# Altium project EG8010.PrjPcb
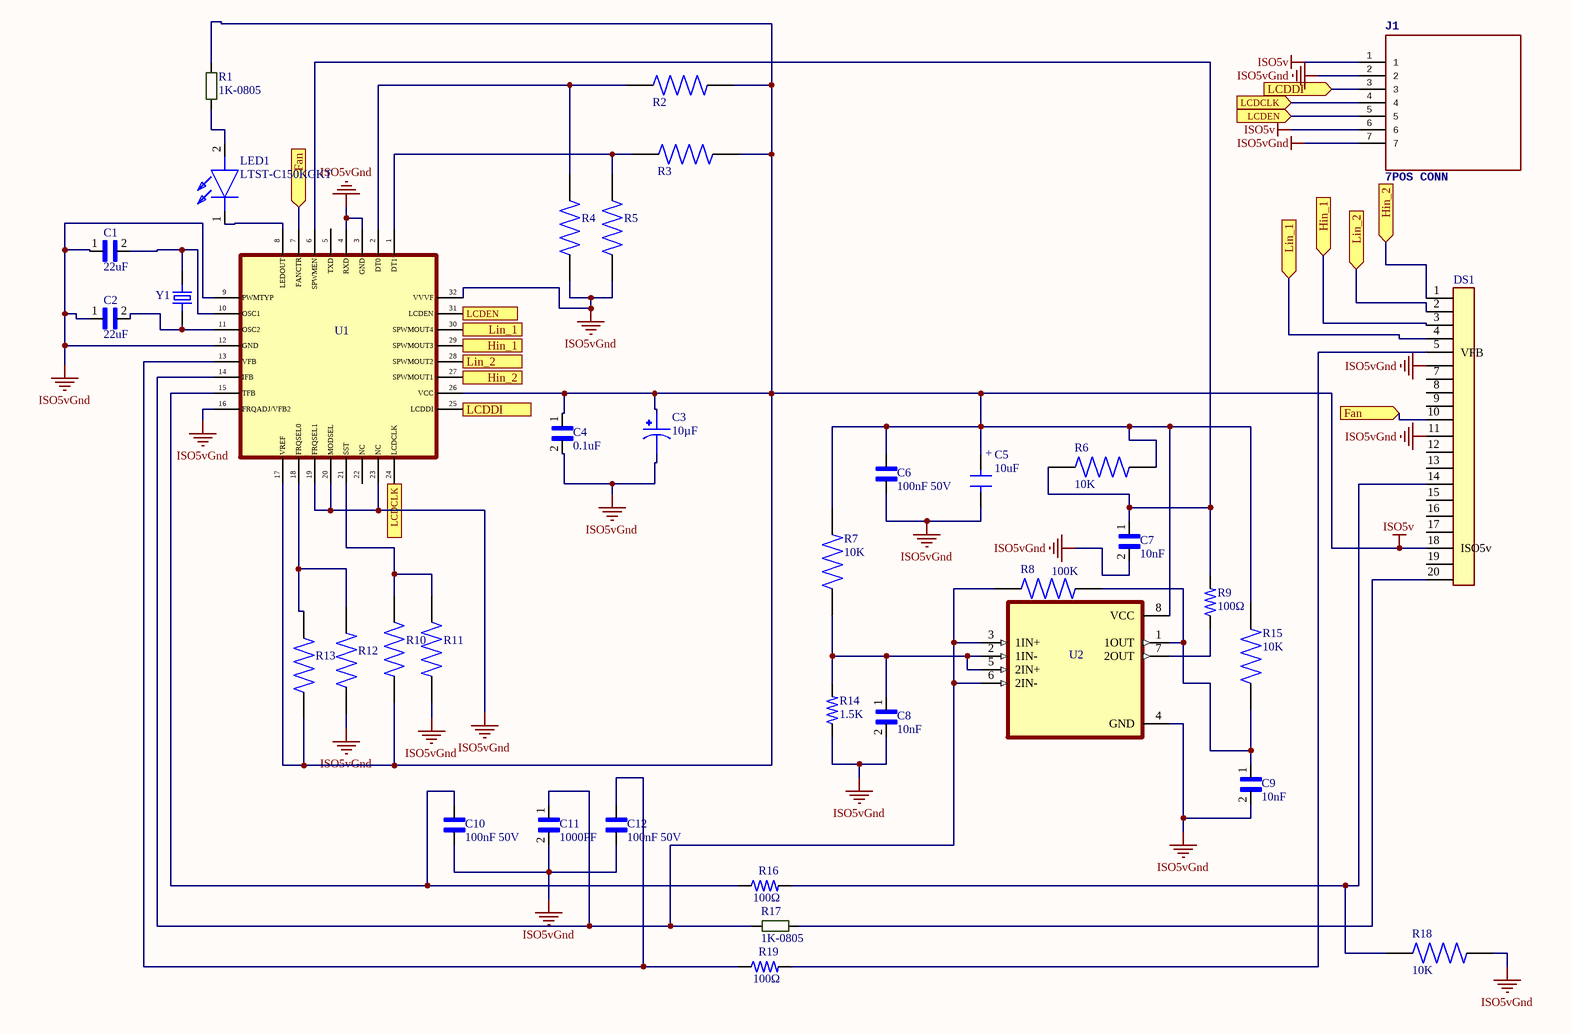
[diagram p0: EG8010.SchDoc]
1 sheet, 37 parts. Net scope: flat (ports and power ports of the same name join across sheets).
Board file: EG8010.PcbDoc

## Sheet EG8010.SchDoc
size A3

### Parts
C1  22uF  [CAPC1608X90N(22uf0603)]
C2  22uF  [CAPC1608X90N(22uf0603)]
C3  10µF  [CAPAE430X550N]
C4  0.1uF  [CAPC2012X88N]
C5  10uF  [CapSmdElc]
C6  100nF 50V  [WCAP-CSGP SMT 0805 100nF 50V]
C7  10nF  [CAPC1608X90N]
C8  10nF  [CAPC1608X90N]
C9  10nF  [CAPC1608X90N]
C10  100nF 50V  [WCAP-CSGP SMT 0805 100nF 50V]
C11  1000PF  [CAPC1608X90]
C12  100nF 50V  [WCAP-CSGP SMT 0805 100nF 50V]
DS1  NHD-0208BZ-FL-YBW  [idc20]  (value not drawn)
J1  7POS CONN  [SAMTEC-SSW-107-02-X-S]
LED1  LTST-C150KGKT  [L-1206]
R1  1K-0805  [R-0805]
R2  *  [RES 0.0 OHM 1206]  (value not drawn)
R3  *  [RES 0.0 OHM 1206]  (value not drawn)
R4  *  [RES 0.0 OHM 1206]  (value not drawn)
R5  *  [RES 0.0 OHM 1206]  (value not drawn)
R6  10K  [RESC1608X55N]
R7  10K  [RESC1608X55N]
R8  100K  [RESC1608X55N]
R9  100Ω  [RESC3115X65N]
R10  *  [RES 0.0 OHM 1206]  (value not drawn)
R11  *  [RES 0.0 OHM 1206]  (value not drawn)
R12  *  [RES 0.0 OHM 1206]  (value not drawn)
R13  *  [RES 0.0 OHM 1206]  (value not drawn)
R14  1.5K  [RESC2012X65N]
R15  10K  [RESC1608X55N]
R16  100Ω  [RESC3115X65N]
R17  1K-0805  [R-0805]
R18  10K  [RESC1608X55N]
R19  100Ω  [RESC3115X65N]
U1  *  [EG8010]  (value not drawn)
U2  *  [SOIC127P599X175-8N]  (value not drawn)
Y1  12MHz  [XTAL_ECS-143-20-23A-EN-TR]  (value not drawn)

### Ports
Fan (in), Hin_1 (in), Hin_2 (in), LCDCLK (in), LCDDI (in), LCDEN (in), Lin_1 (in), Lin_2 (in)

### Nets
ISO5v: C3.1 C4.1 C5.1 C6.2 DS1.18(ISO5v) J1.1 J1.6 R1.2 R2.1 R3.1 R6.1 R7.1 R10.1 R13.1 R15.1 U1.17(VREF) U1.26(VCC) U2.8(VCC)
ISO5vGnd: C1.1 C2.1 C3.2 C4.2 C5.2 C6.1 C7.2 C8.2 C9.2 C10.1 C11.2 C12.1 DS1.6(GND) DS1.11(GND) J1.2 J1.7 R4.1 R5.1 R11.1 R12.1 R14.1 R18.2 U1.3(GND) U1.4(RXD) U1.9(PWMTYP) U1.12(GND) U1.16(FRQADJ/VFB2) U1.19(FRQSEL1) U1.20(MODSEL) U1.23(NC) U1.32(VVVF) U2.4(GND)
NetC1_2: C1.2 U1.10(OSC1) Y1.2(OUT/IN)
NetC2_2: C2.2 U1.11(OSC2) Y1.1(IN/OUT)
NetC7_1: C7.1 R6.2 R9.2 U1.6(SPWMEN)
NetC8_1: C8.1 R7.2 R14.2 U2.2(1IN-) U2.5(2IN+)
NetC9_1: C9.1 R8.1 R15.2 U2.1(1OUT)
NetC10_2: C10.2 R16.1 U1.15(TFB)
NetC11_1: C11.1 R8.2 R17.2 U1.14(IFB) U2.3(1IN+) U2.6(2IN-)
NetC12_2: C12.2 R19.1 U1.13(VFB)
NetDS1_1: DS1.1(VSS) U1.27(SPWMOUT1) ; port Hin_2
NetDS1_2: DS1.2(VDD) U1.28(SPWMOUT2) ; port Lin_2
NetDS1_3: DS1.3(V0) U1.29(SPWMOUT3) ; port Hin_1
NetDS1_4: DS1.4(RS) U1.30(SPWMOUT4) ; port Lin_1
NetDS1_5: DS1.5(VFB) R19.2
NetDS1_10: DS1.10(DB3) U1.7(FANCTR) ; port Fan
NetDS1_14: DS1.14(DB7) R16.2 R18.1
NetDS1_20: DS1.20 R17.1
NetJ1_3: J1.3 U1.25(LCDDI) ; port LCDDI
NetJ1_4: J1.4 U1.24(LCDCLK) ; port LCDCLK
NetJ1_5: J1.5 U1.31(LCDEN) ; port LCDEN
NetLED1_1: LED1.1(K) U1.8(LEDOUT)
NetLED1_2: LED1.2(A) R1.1
NetR2_2: R2.2 R4.2 U1.2(DT0)
NetR3_2: R3.2 R5.2 U1.1(DT1)
NetR9_1: R9.1 U2.7(2OUT)
NetR10_2: R10.2 R11.2 U1.21(SST)
NetR12_2: R12.2 R13.2 U1.18(FRQSEL0)

Not connected (* = marked no-connect by the designer): DS1 7(DB0) 8(DB1) 9(DB2) 12(DB5) 13(DB6) 15 16 17 19; U1 5(TXD) 22(NC)

### Notes on the sheet
- (in symbol C-10uf) +

### Library data of the parts
C1 C2 = CAP 22uF 0603: 22ÂµF Â±20% 6.3V Ceramic Capacitor X5R 0603 (1608 Metric); MP: CL10A226MQ8NRNC; MF: Samsung Electro-Mechanics; SnapEDA_Link: https://www.snapeda.com/parts/CL10A226MQ8NRNC/Samsung%20Electro-Mechanics/view-part/3597960/?ref=snap; Arrow_Americas-Purchase-URL: https://snapeda.com/shop?store=Arrow+Americas&id=3597960; Package: 0603 Samsung; DigiKey-Purchase-URL: https://snapeda.com/shop?store=DigiKey&id=3597960; Value: *; Digi-Key_Part_Number: 1276-1193-1-ND
C3 = 10µF 16V Electrolytic Cap: 10ÂµF 16V Aluminum Electrolytic Capacitors Radial, Can - SMD 2000 Hrs @ 85Â°C; MP: EEE-1CA100SR; MF: Panasonic; SnapEDA_Link: https://www.snapeda.com/parts/EEE-1CA100SR/Panasonic%20Electronic%20Components/view-part/1408599/?ref=snap; Digi-Key_Purchase_URL: https://www.digikey.com/product-detail/en/panasonic-electronic-components/EEE-1CA100SR/PCE3878CT-ND/766254?utm_source=snapeda&utm_medium=aggregator&utm_campaign=symbol; Package: Radial Panasonic; Value: *; Digi-Key_Part_Number: PCE3878CT-ND
C4 = CAP 0.1uF SMD 0805: Cap Ceramic 0.1uF 35V X7R 10% SMD 0805 125Â°C Paper T/R; MP: C0805C104K6RACTU; MF: KEMET; SnapEDA_Link: https://www.snapeda.com/parts/C0805C104K6RACTU/KEMET/view-part/2037626/?ref=snap; Value: *; Availability: Unavailable; Package: 0805 KEMET; Price: None
C5 = C-10uf
C6 C10 C12 = CAP 100nF 50V SMT 0805: WCAP-CSGP General Purpose MLCC; SMT 0805; X7R; 100nF 10%; 50V; -55C to +125C; Tech. PN X7R0805104K050DFCT10000; MF: Wurth Electronics Inc; MP: 885012207098; Availability: Warning; Mouser-Purchase-URL: https://snapeda.com/shop?store=Mouser&id=4217223; Price: None; DigiKey-Purchase-URL: https://snapeda.com/shop?store=DigiKey&id=4217223; Package: 0805 Wurth Electronics; Value: *; SnapEDA_Link: https://www.snapeda.com/parts/885012207098/Wurth%20Electronics%20Inc/view-part/4217223/?ref=snap; BuyPart: https://www.snapeda.com/parts/885012207098/Wurth%20Electronics%20Inc/view-part/4217223/?ref=eda
C7-C9 = CAP 10nF 50V: 10000pF Â±10% 50V Ceramic Capacitor X7R 0603 (1608 Metric); MF: Samsung Electro-Mechanics; MP: CL10B103KB8NNNC; Value: *; Price: None; Package: 0603 Samsung; SnapEDA_Link: https://www.snapeda.com/parts/CL10B103KB8NNNC/Samsung%20Electro-Mechanics/view-part/3597959/?ref=snap; Availability: Unavailable; BuyPart: https://www.snapeda.com/parts/CL10B103KB8NNNC/Samsung%20Electro-Mechanics/view-part/3597959/?ref=eda
C11 = CAP 0603 1000PF: SURFACE-MOUNT CERAMIC MULTILAYER CAPACITORS; MP: CC0603KRX7RYBB102; Package: None; Price: None; Value: *; Availability: Unavailable
DS1 = NHD-0208BZ-FL-YBW: Display; Manufacturer_Name: Newhaven Display; Allied_Number: 70518052; Datasheet Link: https://www.newhavendisplay.com/specs/NHD-0208BZ-FL-YBW.pdf; Height: 13.5mm; Manufacturer_Part_Number: NHD-0208BZ-FL-YBW; Mouser Part Number: 763-0208BZ-FL-YBW; Mouser Price/Stock: https://www.mouser.com/Search/Refine.aspx?Keyword=763-0208BZ-FL-YBW; Allied Price/Stock: https://www.alliedelec.com/newhavendisplayinternational-nhd-0208bz-fl-ybw/70518052/
LED1 = LTST-C150KGKT: LED; Manufacturer_Name: Lite-On; Datasheet Link: http://optoelectronics.liteon.com/upload/download/ds22-2000-072/ltst-c150kgkt.pdf; Height: 1.2mm; Manufacturer_Part_Number: LTST-C150KGKT; Mouser Part Number: 859-LTST-C150KGKT; Mouser Price/Stock: https://www.mouser.com/Search/Refine.aspx?Keyword=859-LTST-C150KGKT; RS Part Number: 6920871; RS Price/Stock: https://uk.rs-online.com/web/p/products/6920871
R1 R17 = R-0805
R2-R5 R10-R13 = RES 0.0 Ω 1206
R6 R7 R15 R18 = RES 10Kohm 0603: 10 kOhms Â±1% 0.25W, 1/4W Chip Resistor 0603 (1608 Metric) Automotive AEC-Q200, Pulse Withstanding Thick Film; MF: Rohm; MP: ESR03EZPF1002; Value: *; SnapEDA_Link: https://www.snapeda.com/parts/ESR03EZPF1002/Rohm/view-part/975090/?ref=snap; Mouser-Purchase-URL: https://snapeda.com/shop?store=Mouser&id=975090; Availability: Unavailable; Price: None; DigiKey-Purchase-URL: https://snapeda.com/shop?store=DigiKey&id=975090; Package: 1608 Rohm Semiconductor
R8 = RES 100KOHM 0603: 100 kOhms ±0.25% 0.1W, 1/10W Chip Resistor 0603 (1608 Metric) Anti-Sulfur, Automotive AEC-Q200, Moisture Resistant Thin Film; MP: AT0603CRD07100KL; Package: None; Price: None; Value: *; Availability: Unavailable
R9 R16 R19 = RES 100OHM: RP 2B 100R 0.1% 15PPM CUT LENG; MP: 8-1879255-5; Package: None; Price: None; Value: *; Availability: Unavailable
R14 = RES 1.5K 0805: RN 0805 1K5 0.1% 10PPM CUT LENGTH; MP: 1676237-1; Package: None; Price: None; Value: *; Availability: Unavailable
U1 = EG8010: EG8010 is a CMOS IC that integrates SPWM sinusoid generator, dead / time control circuit, range divider，soft start circuit, circuit protection, RS232 serial communication, / 12832 serial LCD unit, and etc.
U2 = LM393D: Dual differential comparator, commercial grade 8-SOIC 0 to 70; MF: Texas Instruments; SnapEDA_Link: https://www.snapeda.com/parts/LM393D/Texas%20Instruments/view-part/4806035/?ref=snap; Package: SOIC-8 Texas Instruments; Availability: Good; Value: *; MP: LM393D; Mouser-Purchase-URL: https://snapeda.com/shop?store=Mouser&id=4806035; Arrow_Electronics-Purchase-URL: https://snapeda.com/shop?store=Arrow+Electronics&id=4806035; Price: None; Texas_Instruments-Purchase-URL: https://snapeda.com/shop?store=Texas+Instruments&id=4806035; BuyPart: https://www.snapeda.com/parts/LM393D/Texas%20Instruments/view-part/4806035/?ref=eda
Y1 = ECS-120-20-23A-TR: Crystals 12MHz 20pF 50ppm -10C +70C; MF: ECS International; SnapEDA_Link: https://www.snapeda.com/parts/ECS-120-20-23A-TR/ECS%20International/view-part/511443/?ref=snap; Price: None; MP: ECS-120-20-23A-TR; Value: *; Check_prices: https://www.snapeda.com/parts/ECS-120-20-23A-TR/ECS%20International/view-part/511443/?ref=eda; Availability: Warning; Purchase-URL: https://pricing.snapeda.com/search/part/ECS-120-20-23A-TR/?ref=eda; Package: SMD-2 ECS International